# EAGLE schematic nrf_can (EAGLE 6.5.0)
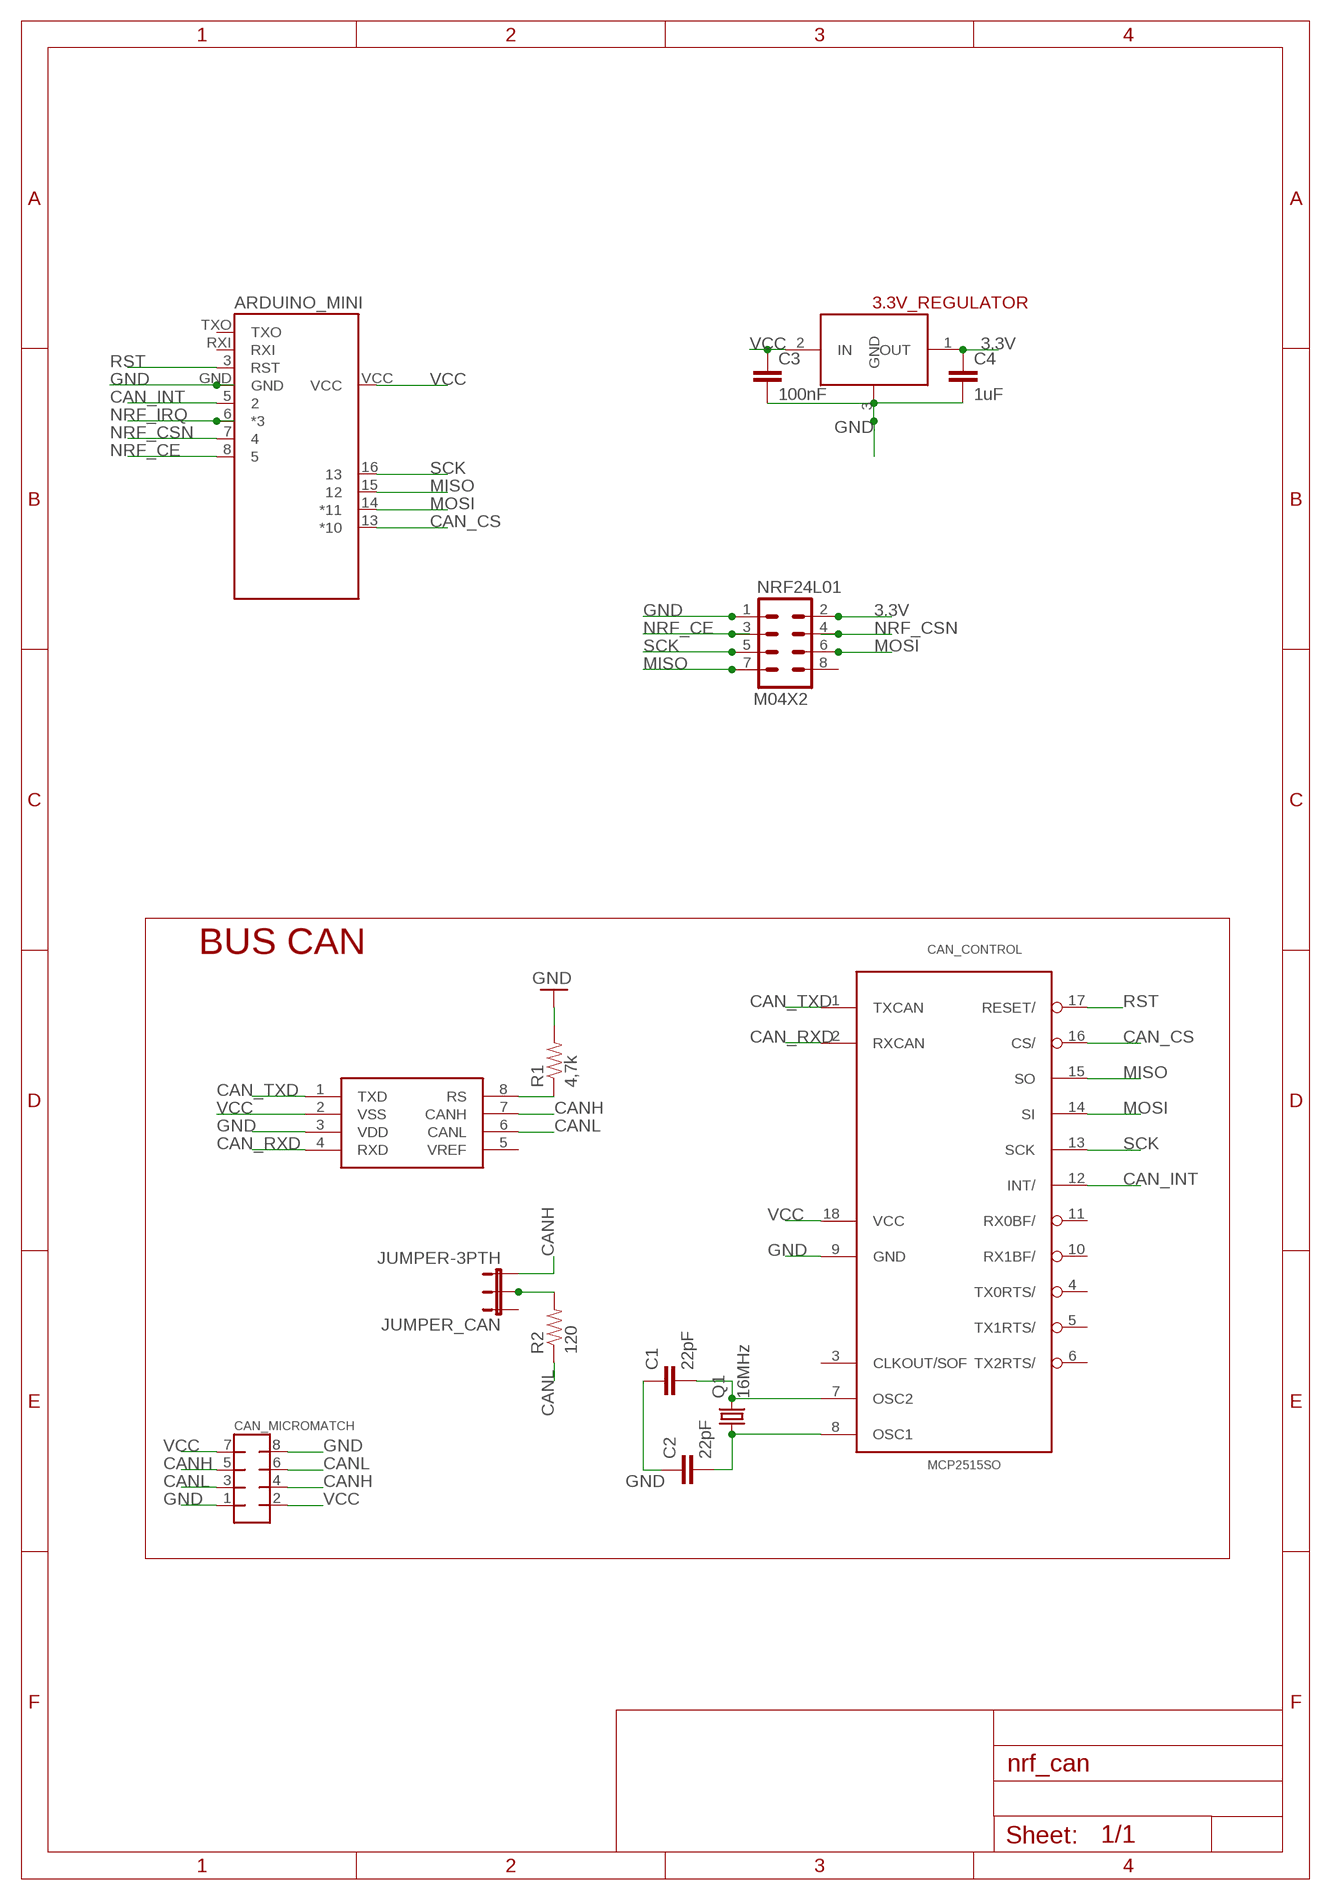
[diagram p0: schematic, sheet 1]

## Parts
3.3V_REGULATOR  LM3480IM4  [SOT23-3]
ARDUINO_MINI  ARDUINO_PRO_MININRF24L01  [ARDUINO_PRO_MINI]
C1  22pF  CAP0805  [0805]
C2  22pF  CAP0805  [0805]
C3  100nF  CAP0805  [0805]
C4  1uF  CAP0805  [0805]
CAN_CONTROL  MCP2515SO  [SO18L]
CAN_MICROMATCH  MMATCH-8-PTH  [AMP-215079-8]
JUMPER_CAN  JUMPER-3PTH  [1X03]
NRF24L01  M04X2  [2X4]
Q1  16MHz  CRYSTALHC49S  [HC49/S]
R1  4,7k  RESISTOR0805-RES  [0805]
R2  120  RESISTOR0805-RES  [0805]
TRANSCEIVER  MCP2551  [SO08]

## Nets
3.3V: 3.3V_REGULATOR.1(OUT) C4.1 NRF24L01.2
CAN_CS: ARDUINO_MINI.13(*10) CAN_CONTROL.16(CS/)
CAN_INT: ARDUINO_MINI.5 CAN_CONTROL.12(INT/)
CAN_RXD: CAN_CONTROL.2(RXCAN) TRANSCEIVER.4(RXD)
CAN_TXD: CAN_CONTROL.1(TXCAN) TRANSCEIVER.1(TXD)
CANH: CAN_MICROMATCH.4 CAN_MICROMATCH.5 JUMPER_CAN.3 TRANSCEIVER.7(CANH)
CANL: CAN_MICROMATCH.3 CAN_MICROMATCH.6 R2.1 TRANSCEIVER.6(CANL)
GND: 3.3V_REGULATOR.3(GND) ARDUINO_MINI.GND C1.1 C2.1 C3.2 C4.2 CAN_CONTROL.9(GND) CAN_MICROMATCH.1 CAN_MICROMATCH.8 NRF24L01.1 R1.2 TRANSCEIVER.3(VDD)
MISO: ARDUINO_MINI.15 CAN_CONTROL.15(SO) NRF24L01.7
MOSI: ARDUINO_MINI.14(*11) CAN_CONTROL.14(SI) NRF24L01.6
N$2: C1.2 CAN_CONTROL.7(OSC2) Q1.2
N$3: C2.2 CAN_CONTROL.8(OSC1) Q1.1
N$5: R1.1 TRANSCEIVER.8(RS)
N$7: JUMPER_CAN.2 R2.2
NRF_CE: ARDUINO_MINI.8 NRF24L01.3
NRF_CSN: ARDUINO_MINI.7 NRF24L01.4
NRF_IRQ: ARDUINO_MINI.6(*3)
RST: ARDUINO_MINI.3(RST) CAN_CONTROL.17(RESET/)
SCK: ARDUINO_MINI.16 CAN_CONTROL.13(SCK) NRF24L01.5
VCC: 3.3V_REGULATOR.2(IN) ARDUINO_MINI.VCC C3.1 CAN_CONTROL.18(VCC) CAN_MICROMATCH.2 CAN_MICROMATCH.7 TRANSCEIVER.2(VSS)
Unconnected: ARDUINO_MINI.RXI ARDUINO_MINI.TXO CAN_CONTROL.3(CLKOUT/SOF) CAN_CONTROL.4(TX0RTS/) CAN_CONTROL.5(TX1RTS/) CAN_CONTROL.6(TX2RTS/) CAN_CONTROL.10(RX1BF/) CAN_CONTROL.11(RX0BF/) JUMPER_CAN.1 NRF24L01.8 TRANSCEIVER.5(VREF)

## Notes on the sheet
- BUS CAN

## Library data of the parts
3.3V_REGULATOR = SparkFun-PowerIC:LM3480IM4: Small package linear regulator
ARDUINO_MINI = nrf_can:ARDUINO_PRO_MINI
C1-C4 = SparkFun-Capacitors:CAP: Capacitor Standard 0603 ceramic capacitor, and 0.1" leaded capacitor.
CAN_CONTROL = MCP2515_MT:MCP2515*: MCP2515 Standalone CAN-Controller by Microchip Eagle-Lib. by MartinThomas
CAN_MICROMATCH = jt-con-micromatch:MMATCH-8-*: AMP Micromatch 8-pin
JUMPER_CAN = SparkFun-Passives:JUMPER-3
NRF24L01 = SparkFun-Connectors:M04X2: .1" header, two rows of four.
Q1 = adafruit:CRYSTAL: CRYSTAL; OC_FARNELL: 1667008; OC_NEWARK: unknown
R1 R2 = SparkFun-Passives:RESISTOR: Resistor Basic schematic elements and footprints for 0603, 1206, and PTH resistors.
TRANSCEIVER = SparkFun-DigitalIC:MCP2551: CAN transceiver

## Net classes
0 default: clearance 0.205 mm